# Altium schematic sheet TCP_CONNECTOR.SchDoc
size A4
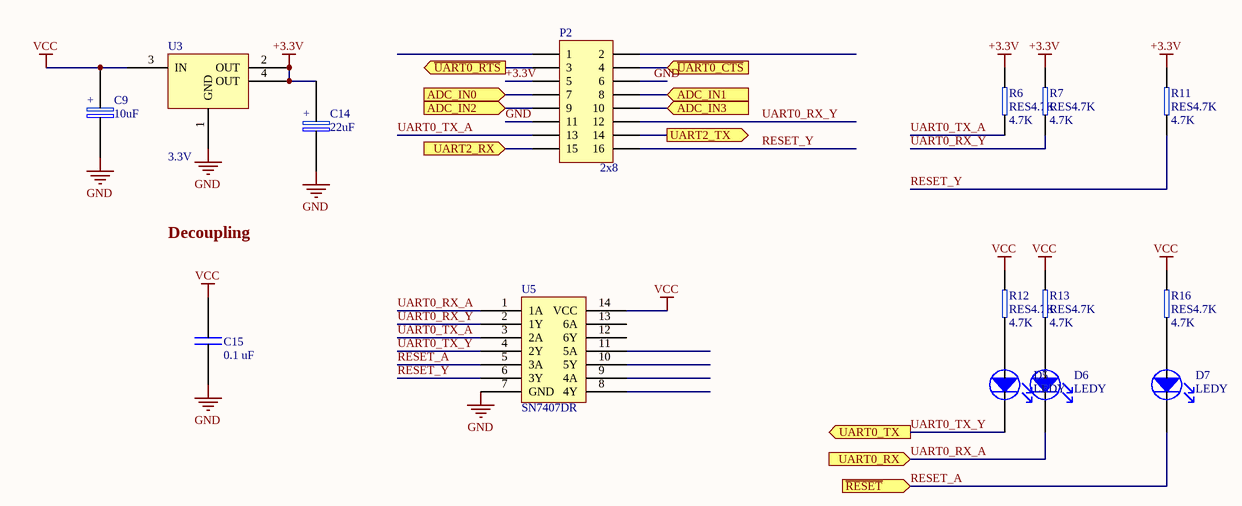
[diagram p0: TCP_CONNECTOR.SchDoc]

## Parts
C9  value 10uF  [CAP0805]  (hidden comment: CAP10uF)
C14  value 22uF  [CAP0805]  (hidden comment: CAP22uF)
C15  value 0.1 uF  [CAP0603]  (hidden comment: CAP0.1uF)
D5  LEDY  [150060YS75000]
D6  LEDY  [150060YS75000]
D7  LEDY  [150060YS75000]
P2  value 2x8  [HDR2X8]  (hidden comment: 826925-8)
R6  RES4.7K  value 4.7K  [RES0603]
R7  RES4.7K  value 4.7K  [RES0603]
R11  RES4.7K  value 4.7K  [RES0603]
R12  RES4.7K  value 4.7K  [RES0603]
R13  RES4.7K  value 4.7K  [RES0603]
R16  RES4.7K  value 4.7K  [RES0603]
U3  value 3.3V  [AZ1117H-3.3TRE1]  (hidden comment: AZ1117H-3.3TRE1)
U5  SN7407DR  [SOIC14]

## Ports
ADC_IN0 (in), ADC_IN1 (in), ADC_IN2 (in), ADC_IN3 (in), UART0_RX (in), UART0_TX (out), UART2_RX (in), UART2_TX (out), ~{RESET} (in), ~{UART0_CTS} (in), ~{UART0_RTS} (out)

## Nets
+3.3V: C14.1(pos) P2.5 R6.1(pos) R7.1(pos) R11.1(pos) U3.2(OUT) U3.4(OUT)
GND: C9.2(neg) C14.2(neg) C15.2 P2.6 P2.11 U3.1(GND) U5.7(GND)
VCC: C9.1(pos) C15.1 R12.1(pos) R13.1(pos) R16.1(pos) U3.3(IN) U5.14(VCC)
~{UART0_CTS}: P2.4 ; port ~{UART0_CTS}
~{UART0_RTS}: P2.3 ; port ~{UART0_RTS}
ADC_IN0: P2.7 ; port ADC_IN0
ADC_IN1: P2.8 ; port ADC_IN1
ADC_IN2: P2.9 ; port ADC_IN2
ADC_IN3: P2.10 ; port ADC_IN3
RESET_A: D7.1(Cathode) U5.5(3A) ; port ~{RESET}
RESET_Y: P2.16 R11.2(neg) U5.6(3Y)
UART0_RX_A: D6.1(Cathode) U5.1(1A) ; port UART0_RX
UART0_RX_Y: P2.12 R7.2(neg) U5.2(1Y)
UART0_TX_A: P2.13 R6.2(neg) U5.3(2A)
UART0_TX_Y: D5.1(Cathode) U5.4(2Y) ; port UART0_TX
UART2_RX: P2.15 ; port UART2_RX
UART2_TX: P2.14 ; port UART2_TX
NetD5_2: D5.2(Anode) R12.2(neg)
NetD6_2: D6.2(Anode) R13.2(neg)
NetD7_2: D7.2(Anode) R16.2(neg)

Not connected (* = marked no-connect by the designer): P2 1 2; U5 8(4Y) 9(4A) 10(5Y) 11(5A) 12(6Y) 13(6A)

## Notes on the sheet
- Labels drawn without touching a wire or pin: Decoupling
- (in symbol CAP10uF) +
- (in symbol CAP22uF) +

## Library data of the parts
C9 = CAP10uF: Capacitores cerámicos de capas múltiples (MLCC) - SMD/SMT 0805 10uF 16volts X5R 10%; MPN: GRM21BR61C106KE15L; Supplier: Mouser; Supplier PN: 81-GRM21BR61C106KE15
C14 = CAP22uF: Capacitores cerámicos de capas múltiples (MLCC) - SMD/SMT 0805 22uF 16volts X5R 20%; MPN: GRM21BR61C226ME44L; Supplier: Mouser; Supplier PN: 81-GRM21BR61C226ME4L
C15 = C0.1UF: Capacitores cerámicos de capas múltiples (MLCC) - SMD/SMT 0603 0.1uF 16volts X7R 5%; MPN: VJ0603Y104JXJPW1BC; Supplier PN: 77-VJ0603Y104JXJPBC; Supplier: Mouser
D5-D7 = LEDY: LED estándar - SMD (montaje superficial) WL-SMCW SMDMono TpVw Waterclr 0603 Yellow; Supplier: Mouser; Supplier PN: 710-150060YS75000; MPN: 150060YS75000; Value: Yellow
P2 = Header 8X2: Alojamientos de cables y cabecera 2X08 POS VERT TIN; Supplier: Mouser; Supplier PN: 571-826925-8; MPN: 826925-8
R6 R7 R11-R13 R16 = RES4.7K: Resistores de película gruesa - SMD 1/10watt 4.7Kohms 1%; MPN: CRCW06034K70FKEA; Supplier PN: 71-CRCW0603-4.7K-E3; Supplier: Mouser
U3 = AZ1117H-3.3TRE1: Reguladores de tensión lineal LDO BJT HiCurr 1.15V at 1A; Supplier: Mouser; Supplier PN: 621-AZ1117H-3.3TRE1; MPN: AZ1117H-3.3TRE1
U5 = SN7407DR: Búfers y controladores de línea Hex Buffer/Driver; Value: Hex Budder/Driver; Supplier: Mouser; Supplier PN: 595-SN7407DR; MPN: SN7407DR